# Altium schematic sheet Hotfire_1.SchDoc
size A4; Engineer: * Inez and Rohith ♡; SheetNumber: 1; SheetTotal: 2
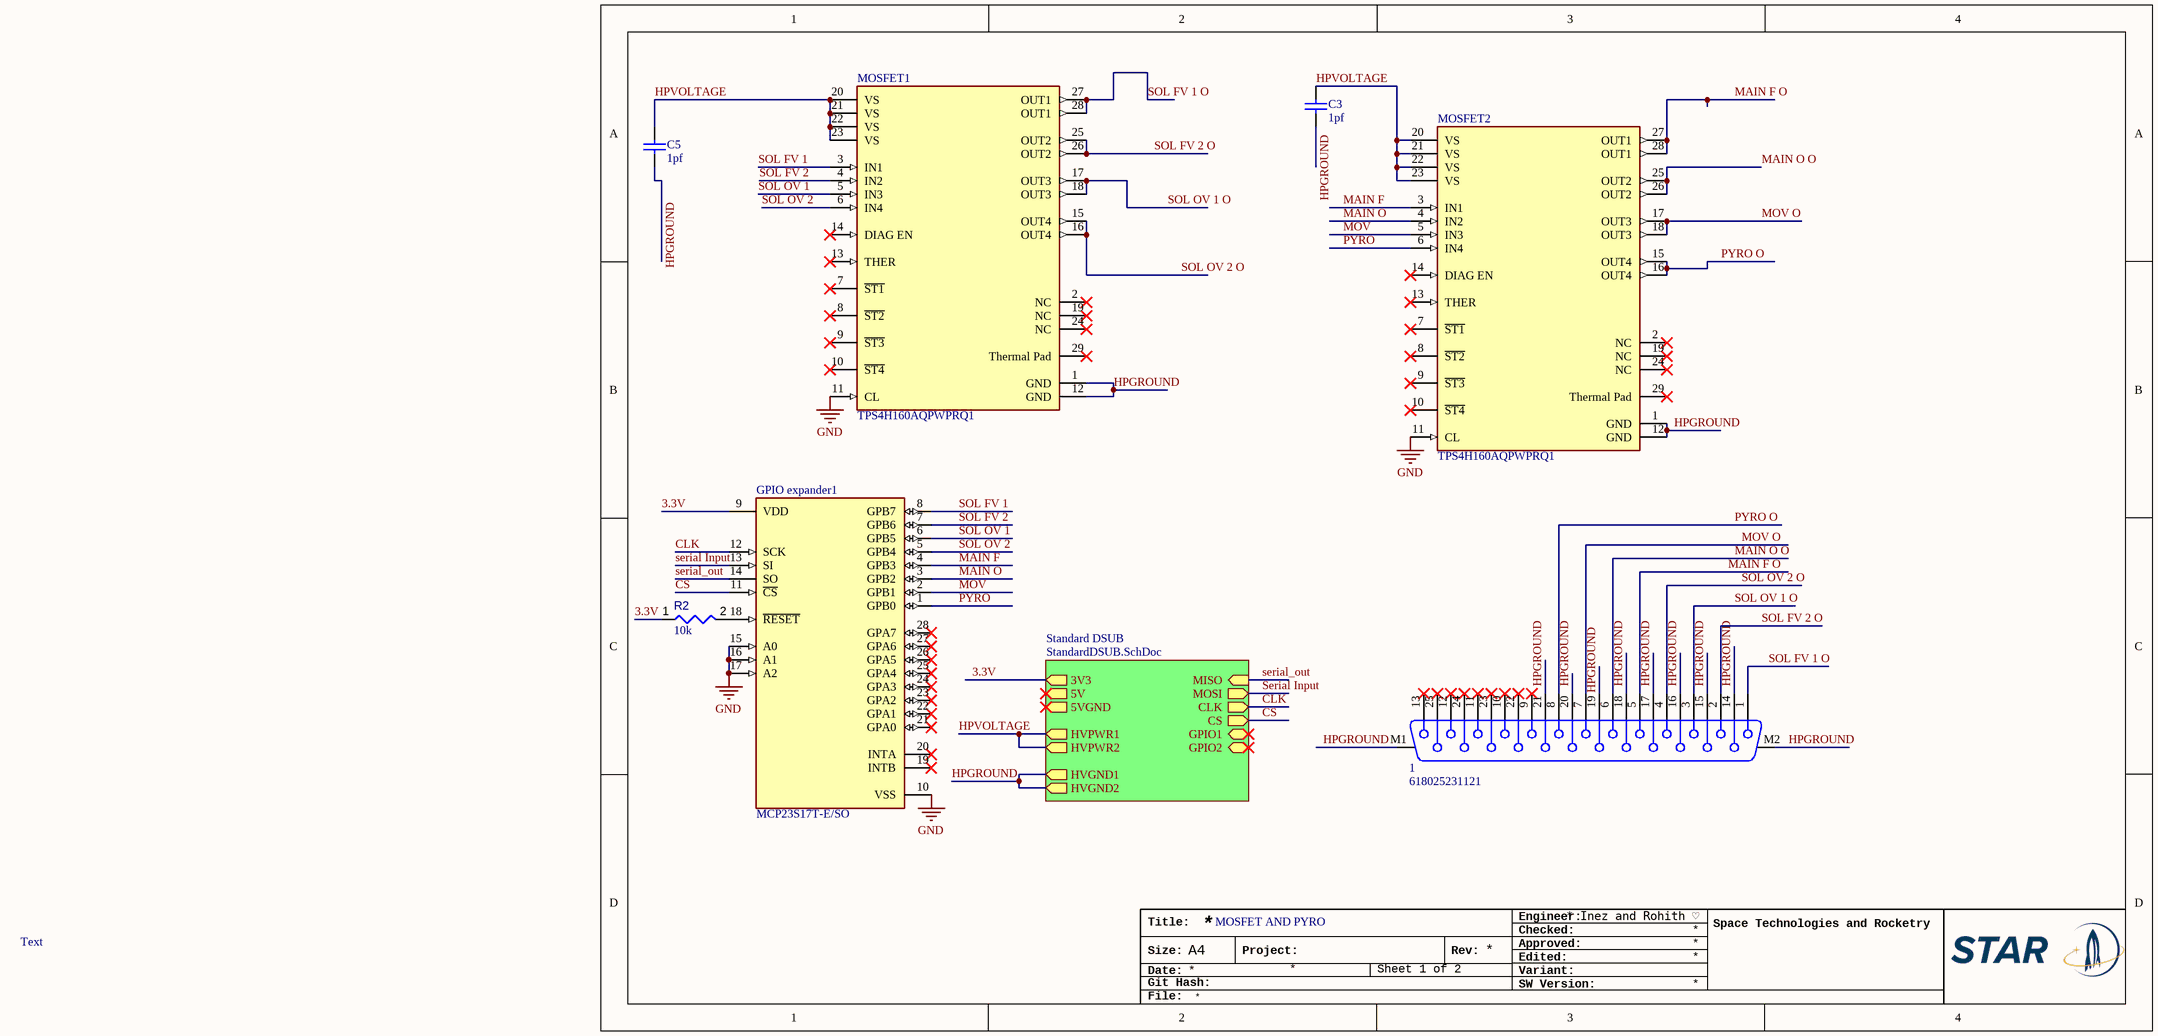
[diagram p0: Hotfire_1.SchDoc]

## Parts
1  618025231121  [618025231121]
C3  1pf  [CAPC2013X140X50NL20T25]
C5  1pf  [CAPC2013X140X50NL20T25]
GPIO_expander1  MCP23S17T-E/SO  [FP-C04-052-IPC_A]
MOSFET1  TPS4H160AQPWPRQ1  [FP-PWP0028C-IPC_B]
MOSFET2  TPS4H160AQPWPRQ1  [FP-PWP0028C-IPC_B]
R2  value 10k  [RESC1608X55X25ML10T15]  (hidden comment: Resistor 10k +/-1% 0603 100 mW)

## Sub-sheets
Standard DSUB = StandardDSUB.SchDoc: GPIO1 (bidir), MISO (in), MOSI (out), CLK (out), CS (out), GPIO2 (bidir), 3V3 (out), 5V (out), 5VGND (out), HVPWR1 (out), HVPWR2 (out), HVGND1 (out), HVGND2 (out)

## Nets
GND: GPIO_expander1.10(VSS) GPIO_expander1.15(A0) GPIO_expander1.16(A1) GPIO_expander1.17(A2) MOSFET1.11(CL) MOSFET2.11(CL)
3.3V: GPIO_expander1.9(VDD) R2.1 ; sheet Standard DSUB/3V3
CLK: GPIO_expander1.12(SCK) ; sheet Standard DSUB/CLK
CS: GPIO_expander1.11(~{CS}) ; sheet Standard DSUB/CS
HPGROUND: 1.14 1.15 1.16 1.17 1.18 1.19 1.20 1.21 1.M1 1.M2 C3.2 C5.2 MOSFET1.1(GND) MOSFET1.12(GND) MOSFET2.1(GND) MOSFET2.12(GND) ; sheet Standard DSUB/HVGND1, sheet Standard DSUB/HVGND2
HPVOLTAGE: C3.1 C5.1 MOSFET1.20(VS) MOSFET1.21(VS) MOSFET1.22(VS) MOSFET1.23(VS) MOSFET2.20(VS) MOSFET2.21(VS) MOSFET2.22(VS) MOSFET2.23(VS) ; sheet Standard DSUB/HVPWR1, sheet Standard DSUB/HVPWR2
MAIN F: GPIO_expander1.4(GPB3) MOSFET2.3(IN1)
MAIN F O: 1.5 MOSFET2.27(OUT1) MOSFET2.28(OUT1)
MAIN O: GPIO_expander1.3(GPB2) MOSFET2.4(IN2)
MAIN O O: 1.6 MOSFET2.25(OUT2) MOSFET2.26(OUT2)
MOV: GPIO_expander1.2(GPB1) MOSFET2.5(IN3)
MOV O: 1.7 MOSFET2.17(OUT3) MOSFET2.18(OUT3)
PYRO: GPIO_expander1.1(GPB0) MOSFET2.6(IN4)
PYRO O: 1.8 MOSFET2.15(OUT4) MOSFET2.16(OUT4)
Serial Input: GPIO_expander1.13(SI) ; sheet Standard DSUB/MOSI
serial_out: GPIO_expander1.14(SO) ; sheet Standard DSUB/MISO
SOL FV 1: GPIO_expander1.8(GPB7) MOSFET1.3(IN1)
SOL FV 1 O: 1.1 MOSFET1.27(OUT1) MOSFET1.28(OUT1)
SOL FV 2: GPIO_expander1.7(GPB6) MOSFET1.4(IN2)
SOL FV 2 O: 1.2 MOSFET1.25(OUT2) MOSFET1.26(OUT2)
SOL OV 1: GPIO_expander1.6(GPB5) MOSFET1.5(IN3)
SOL OV 1 O: 1.3 MOSFET1.17(OUT3) MOSFET1.18(OUT3)
SOL OV 2: GPIO_expander1.5(GPB4) MOSFET1.6(IN4)
SOL OV 2 O: 1.4 MOSFET1.15(OUT4) MOSFET1.16(OUT4)
NetGPIO_expander1_18: GPIO_expander1.18(~{RESET}) R2.2

Not connected (* = marked no-connect by the designer): 1 9* 10* 11* 12* 13* 22* 23* 24* 25*; GPIO_expander1 19(INTB)* 20(INTA)* 21(GPA0)* 22(GPA1)* 23(GPA2)* 24(GPA3)* 25(GPA4)* 26(GPA5)* 27(GPA6)* 28(GPA7)*; MOSFET1 2(NC)* 7(~{ST1})* 8(~{ST2})* 9(~{ST3})* 10(~{ST4})* 13(THER)* 14(DIAG_EN)* 19(NC)* 24(NC)* 29(Thermal_Pad)*; MOSFET2 2(NC)* 7(~{ST1})* 8(~{ST2})* 9(~{ST3})* 10(~{ST4})* 13(THER)* 14(DIAG_EN)* 19(NC)* 24(NC)* 29(Thermal_Pad)*

## Notes on the sheet
- MOSFET AND PYRO
- Text
- Title:
- Engineer:
- Checked:
- Space Technologies and Rocketry
- Size:
- Date:
- Git Hash:
- A4
- Project:
- Rev:
- SW Version:
- Variant:
- Edited:
- Approved:
- File:

## Library data of the parts
1 = CMP-1502-00202-2: NexarPartId: 18818207; Pitch: 2.77mm; Operating Supply Voltage: 125V; Gender: Female; Insulation Resistance: 5GΩ; Contact Resistance: 30mΩ; Current Rating: 3A; Number of Contacts: 25; Contact Plating: Gold; Width: 12.5mm; RoHS: Compliant; REACH SVHC: Unknown; Min Operating Temperature: -55°C; Termination: SMD/SMT; Voltage Rating: 125V; Mount: Through Hole; Housing Material: Steel; Insulation Material: PBT; Number of Rows: 2; Depth: 18.5mm; Orientation: Right Angle; Number of Pins: 25; Max Operating Temperature: 105°C; Length: 38.33mm
C3 C5 = CMP-2007-04531-1: Manufacturer: AVX Interconnect / Elco; Part Number: 08051A181FAT2A
GPIO_expander1 = CMP-0186-00131-3: IC I/O EXPANDER SPI 16B 28SOIC; Power Dissipation: 700mW; Nominal Supply Current: 1mA; Frequency: 10MHz; Min Supply Voltage: 4.5V; Number of Bits: 16; Max Supply Voltage: 5.5V; Number of Channels: 1; Package Quantity: 1600; Min Operating Temperature: -40°C; Mount: Surface Mount; Lead Free: Lead Free; REACH SVHC: No SVHC; Packaging: Tape and Reel; Interface: SPI; Max Operating Temperature: 125°C; Case/Package: SOIC; Number of Pins: 28; Number of I/Os: 16; Max Frequency: 10MHz
MOSFET1 MOSFET2 = CMP-019-00059-1: Buffer/Inverter Based Peripheral Driver, 2.5A, PDSO28; Min Supply Voltage: 4V; Max Supply Voltage: 40V; Min Operating Temperature: -40°C; Pins: 28; RoHS Compliant: Yes; Case/Package: TSSOP; Max Operating Temperature: 125°C
R2 = CMP-009-00017-5: Chip Resistor, 10 KOhm, +/- 1%, 01 W, -55 to 155 degC, 0603 (1608 Metric); Voltage Rating: 50V; Power: 100mW; RoHS Compliant: True; Min Operating Temperature: -55°C; Pins: 2; Case/Package: 0603; Mounting Technology: SM; Max Operating Temperature: 155°C; Tolerance: 1%